# EAGLE schematic pigtail (EAGLE 7.7.0)
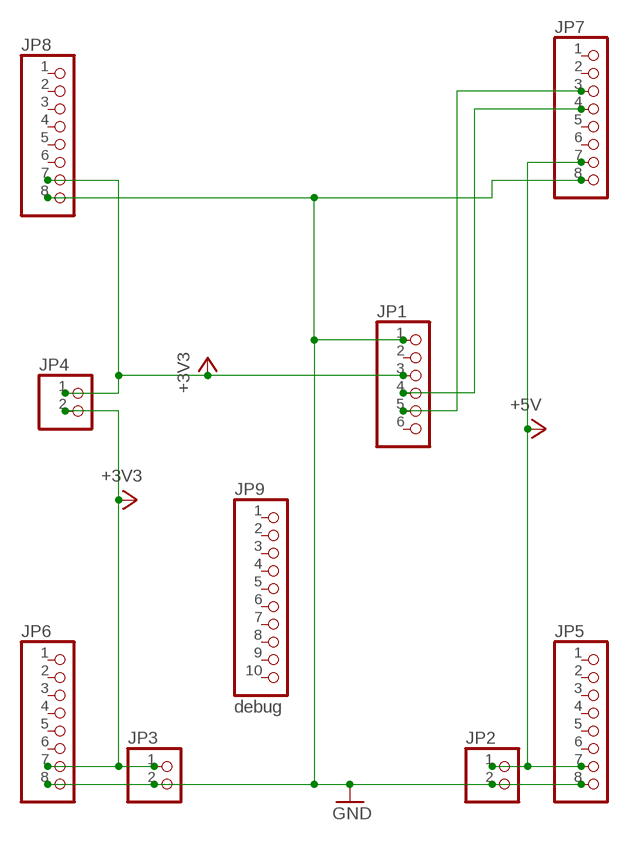
[diagram p0: schematic, sheet 1]

## Parts
JP1  PINHD-1X6  [1X06]
JP2  PINHD-1X2  [1X02]
JP3  PINHD-1X2  [1X02]
JP4  PINHD-1X2  [1X02]
JP5  PINHD-1X8  [1X08]
JP6  PINHD-1X8  [1X08]
JP7  PINHD-1X8  [1X08]
JP8  PINHD-1X8  [1X08]
JP9  debug  PINHD-1X10  [1X10]

## Nets
+3V3: JP1.3 JP3.1 JP4.1 JP4.2 JP6.7 JP8.7
+5V: JP2.1 JP5.7 JP7.7
GND: JP1.1 JP2.2 JP3.2 JP5.8 JP6.8 JP7.8 JP8.8
N$6: JP1.4 JP7.4
N$7: JP1.5 JP7.3
Unconnected: JP1.2 JP1.6 JP5.1 JP5.2 JP5.3 JP5.4 JP5.5 JP5.6 JP6.1 JP6.2 JP6.3 JP6.4 JP6.5 JP6.6 JP7.1 JP7.2 JP7.5 JP7.6 JP8.1 JP8.2 JP8.3 JP8.4 JP8.5 JP8.6 JP9.1 JP9.2 JP9.3 JP9.4 JP9.5 JP9.6 JP9.7 JP9.8 JP9.9 JP9.10

## Library data of the parts
JP1 = pinhead:PINHD-1X6: PIN HEADER
JP2-JP4 = pinhead:PINHD-1X2: PIN HEADER
JP5-JP8 = pinhead:PINHD-1X8: PIN HEADER
JP9 = pinhead:PINHD-1X10: PIN HEADER